# Altium schematic sheet User_interface.SchDoc
size A3; SheetNumber: 7; SheetTotal: 7
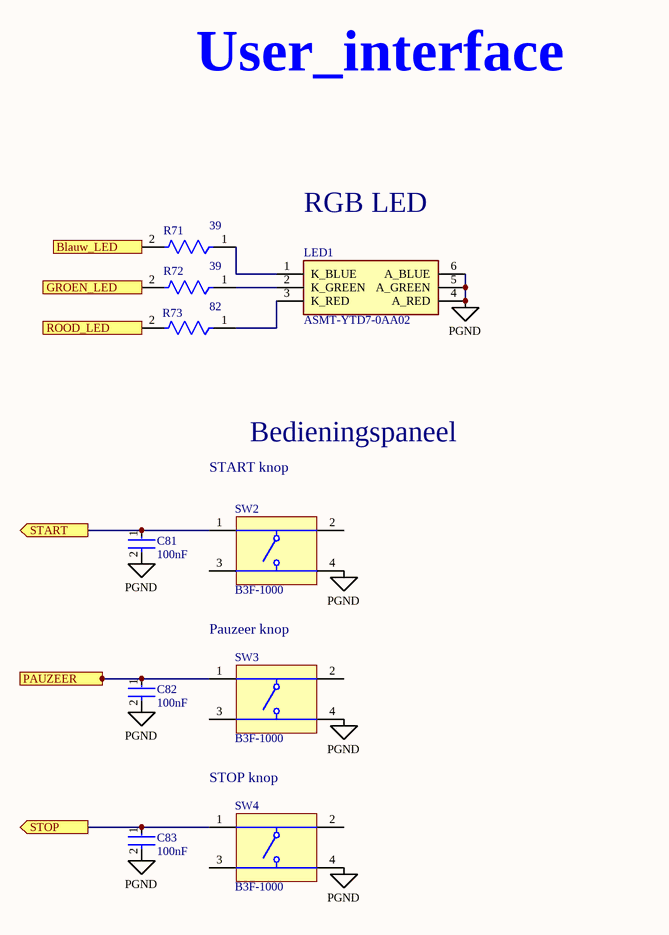
[diagram p0: User_interface.SchDoc]

## Parts
C81  100nF  [FP-GRM15-MFG]
C82  100nF  [FP-GRM15-MFG]
C83  100nF  [FP-GRM15-MFG]
LED1  ASMT-YTD7-0AA02  [ASMTYTD70AA02]
R71  39  [FP-RC1608-IPC_B]
R72  39  [FP-RC1608-IPC_B]
R73  82  [FP-RC1608-IPC_B]
SW2  B3F-1000  [OMRON-B3F-1000-4_V]
SW3  B3F-1000  [OMRON-B3F-1000-4_V]
SW4  B3F-1000  [OMRON-B3F-1000-4_V]

## Ports
Blauw_LED (in, see TOP_scheet[1B]), GROEN_LED (in, see TOP_scheet[1B]), PAUZEER (out, see TOP_scheet[2B]), ROOD_LED (in, see TOP_scheet[1B]), START (out, see TOP_scheet[2B]), STOP (out, see TOP_scheet[2B])

## Nets
PGND: C81.2 C82.2 C83.2 LED1.4(A_RED) LED1.5(A_GREEN) LED1.6(A_BLUE) SW2.4 SW3.4 SW4.4
Blauw_LED: R71.2 ; port Blauw_LED
GROEN_LED: R72.2 ; port GROEN_LED
PAUZEER: C82.1 SW3.1 ; port PAUZEER
ROOD_LED: R73.2 ; port ROOD_LED
START: C81.1 SW2.1 ; port START
STOP: C83.1 SW4.1 ; port STOP
NetLED1_1: LED1.1(K_BLUE) R71.1
NetLED1_2: LED1.2(K_GREEN) R72.1
NetLED1_3: LED1.3(K_RED) R73.1

Not connected (* = marked no-connect by the designer): SW2 2 3; SW3 2 3; SW4 2 3

## Notes on the sheet
- User_interface
- RGB LED
- START knop
- Bedieningspaneel
- Pauzeer knop
- STOP knop

## Library data of the parts
C81-C83 = CMP-2100-03641-2: CAP CER 0.1UF 16V X7R 0402; Manufacturer Part Number: GRM155R71C104KA88D; Manufacturer: Murata; Eurocircuits generic parts: GPC0402104; Standoff Height: 0mm; Tolerance: 10%; Voltage Rating: 16Vdc; Material: Ceramic; Capacitance: 0.10μF; Value: 0.10μF; RoHS: TRUE; Temperature Characteristic: X7R; Octopart: https://octopart.com/grm155r71c104ka88d-murata-196880; Digikey Description: CAP CER 0.1UF 16V X7R 0402; Device Class L3: Ceramic Capacitors; Height: 0.55mm; ComponentLink2Description: Datasheet; Temperature Range Low: -55°C; Ipc Land Pattern Name: CAPC10050X219; ComponentLink2URL: https://search.murata.co.jp/Ceramy/image/img/A01X/G101/ENG/GRM155R71H471KA01-01A.pdf; Device Class L1: Passive Components; Lead Free: yes; Category: Cap; Package: GRM15; Temperature: -55°C to +125°C; Device Class L2: Capacitors; Temperature Range High: +125°C; Mouser Description: 0402 0.1 uF 16V ±10 % Tolerance X7R SMT Multilayer Ceramic Capacitor
LED1 = ASMT-YTD7-0AA02: LED; Manufacturer_Name: Avago Technologies; Datasheet Link: https://docs.broadcom.com/docs/AV02-3873EN; Height: 1.8mm; Manufacturer_Part_Number: ASMT-YTD7-0AA02; Mouser Part Number: 630-ASMT-YTD7-0AA02; Mouser Price/Stock: https://www.mouser.co.uk/ProductDetail/Broadcom-Avago/ASMT-YTD7-0AA02?qs=eJru1qh8zu7rRIK75I%2FMLw%3D%3D
R71 R72 = CMP-13261-004935-1: Res Thick Film 0603 39Ω 1% 0.1W ±100ppm/°C Molded SMD T/R / Generic part Eurocircuits: / GPR060310K; Resistance: 39Ohm; Voltage Rating (DC): 50V; Power Rating: 100mW; Contact Plating: Tin; Depth: 0.8mm; Width: 800um; Tolerance: 1%; Lead Free: Lead Free; Composition: Thick Film; Military Standard: Not; Temperature Coefficient: 100ppm/°C; Radiation Hardening: No; Length: 1.6mm; Case/Package: 0603; Max Operating Temperature: 155°C; Packaging: Tape and Reel; Min Operating Temperature: -55°C; Generic part Eurocircuits:: GPR060310K
R73 = CMP-13261-004935-1: Res Thick Film 0603 82Ω 1% 0.1W ±100ppm/°C Molded SMD T/R / Generic part Eurocircuits: / GPR060310K; Voltage Rating (DC): 50V; Power Rating: 100mW; Resistance: 82; Contact Plating: Tin; Depth: 0.8mm; Width: 800um; Tolerance: 1%; Lead Free: Lead Free; Composition: Thick Film; Military Standard: Not; Temperature Coefficient: 100ppm/°C; Radiation Hardening: No; Length: 1.6mm; Case/Package: 0603; Max Operating Temperature: 155°C; Packaging: Tape and Reel; Min Operating Temperature: -55°C; Generic part Eurocircuits:: GPR060310K
SW2-SW4 = CMP-1677-00002-1: Tactile Switch, SPST-NO, 0.05 A, 5 to 24 V, -25 to 70 degC, 4-Pin THD, RoHS, Bulk; Shielding: Shielded; Gender: Female; Capacitance: -45 f; Voltage Rating: 150 V; Current Rating: 1.5 A; Radiation Hardening: No; Contact Plating: Gold; Height: 14.99 mm; Min Operating Temperature: -40 degC; Packaging: Tray; ComponentLink2Description: Datasheet; ComponentLink1URL: http://www.omron.com/; Lead Pitch: 1.27 mm; RoHSCompliant: true; Pins: 8; PackageReference: B3F-1000; Width: 25.4 mm; Contact Material: Brass; ComponentLink2URL: http://www.omron.com/ecb/products/pdf/en-b3f.pdf; PackageDescription: 4-Pin Through Hole Device, Body 6 x 6 mm; DatasheetVersion: Jan-15; ComponentLink1Description: Manufacturer URL; Package Quantity: 1080; Mount: Through Hole; Length: 18.34 mm; Max Operating Temperature: 70 degC